# EAGLE design backplane_new (EAGLE 8.0.2)
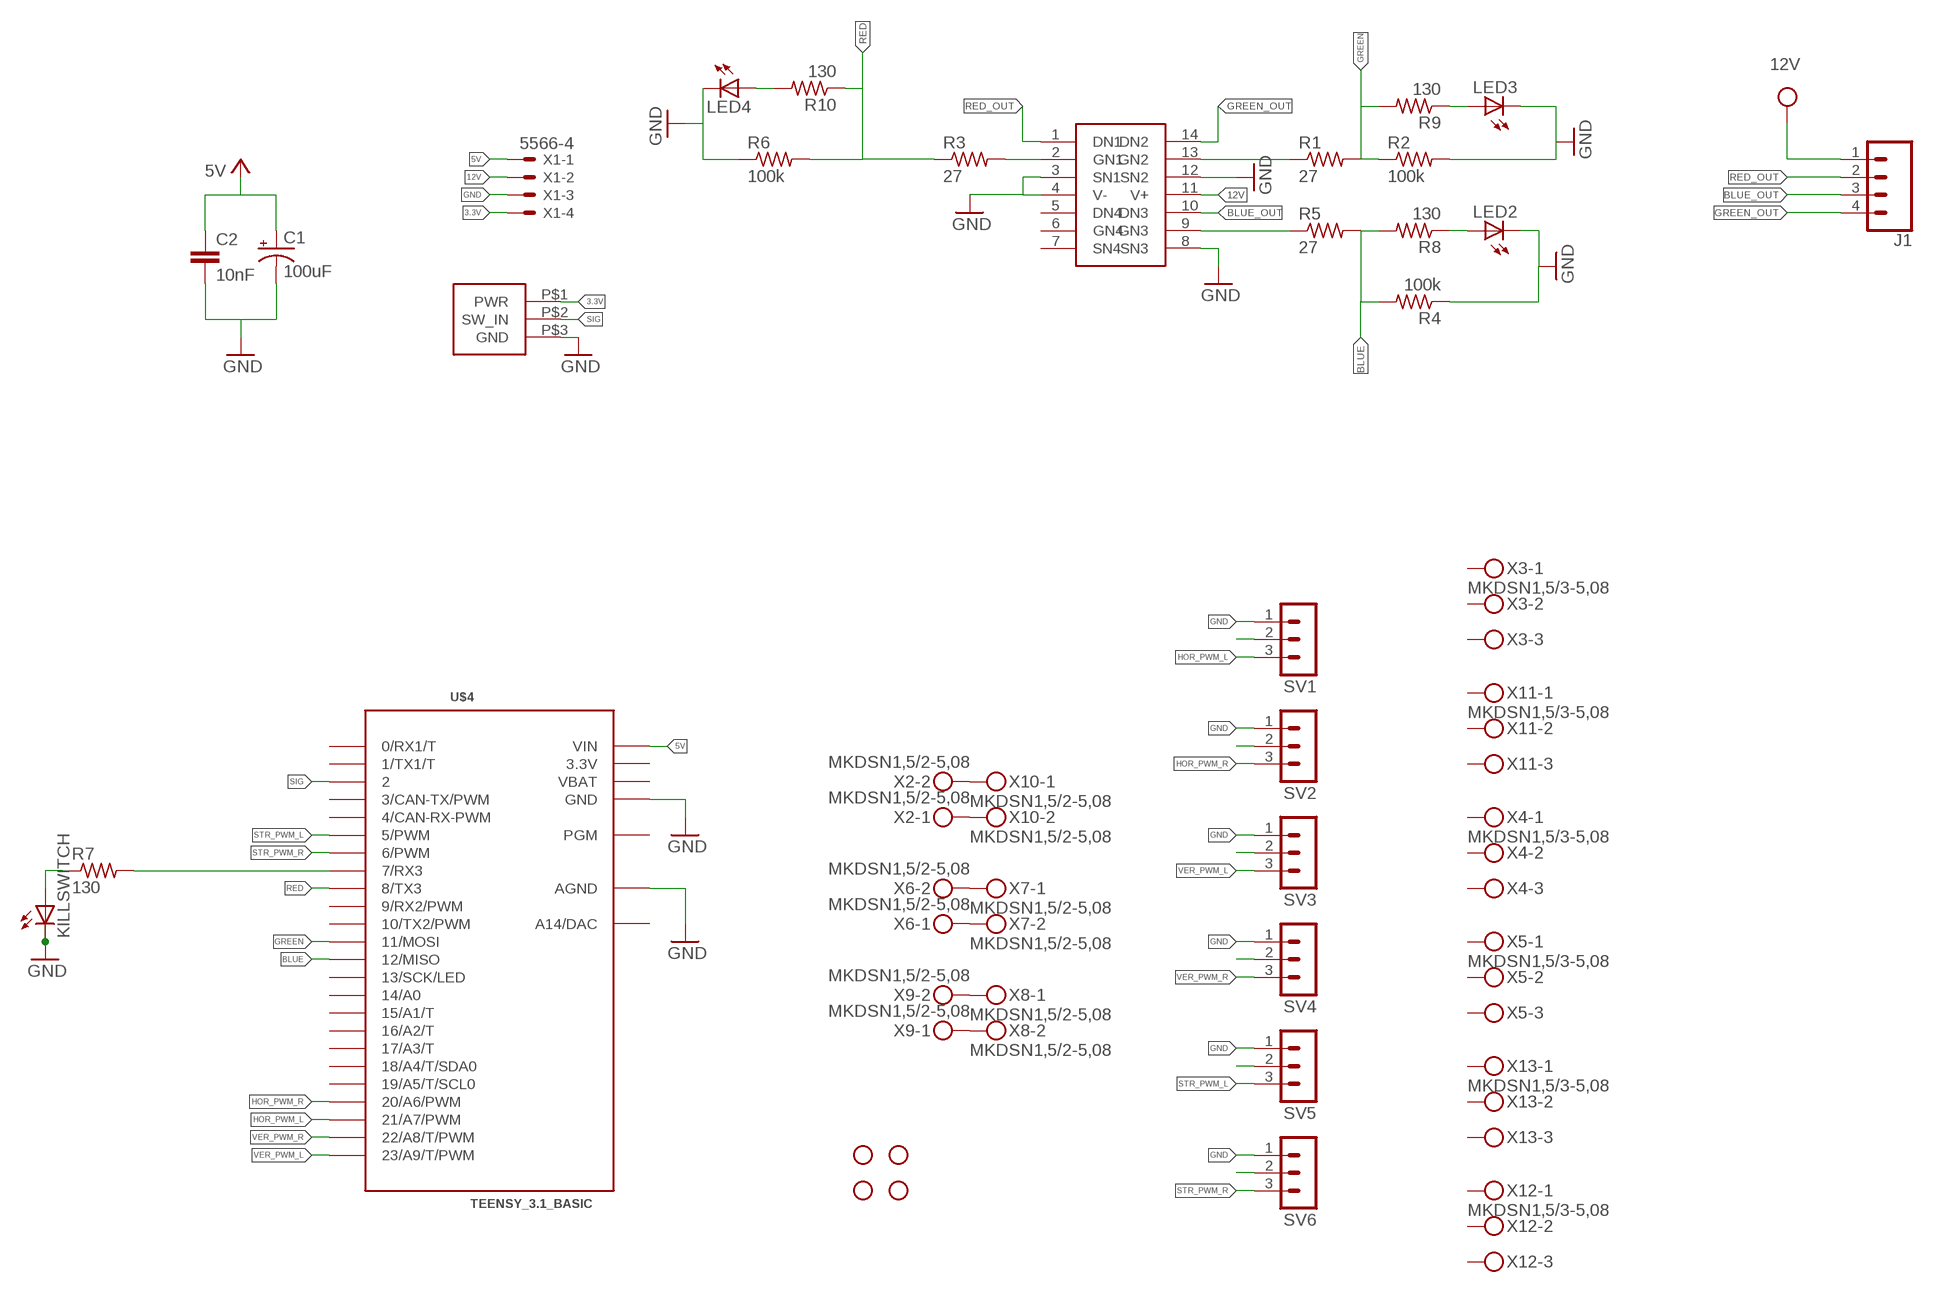
[diagram p0: schematic, sheet 1]

## Parts
C1  100uF  CPOL-USE5-10.5  [E5-10,5]
C2  10nF  C-EUC0805  [C0805]
H1  STAND-OFF  [STAND-OFF]
H2  STAND-OFF  [STAND-OFF]
H3  STAND-OFF  [STAND-OFF]
H5  STAND-OFF  [STAND-OFF]
J1  CONN_04POLAR  [MOLEX-1X4]
KILLSWITCH  LED5MM  [LED5MM]
LED2  LEDCHIP-LED0805  [CHIP-LED0805]
LED3  LEDCHIP-LED0805  [CHIP-LED0805]
LED4  LEDCHIP-LED0805  [CHIP-LED0805]
R1  27  R-US_R0805  [R0805]
R2  100k  R-US_R0805  [R0805]
R3  27  R-US_R0805  [R0805]
R4  100k  R-US_R0805  [R0805]
R5  27  R-US_R0805  [R0805]
R6  100k  R-US_R0805  [R0805]
R7  130  R-US_R0805  [R0805]
R8  130  R-US_R0805  [R0805]
R9  130  R-US_R0805  [R0805]
R10  130  R-US_R0805  [R0805]
SV1  MA03-1  [MA03-1]
SV2  MA03-1  [MA03-1]
SV3  MA03-1  [MA03-1]
SV4  MA03-1  [MA03-1]
SV5  MA03-1  [MA03-1]
SV6  MA03-1  [MA03-1]
U$2  KILL_SW  [KILL_SW]
U$3  ALD1160  [DIL14]
U$4  TEENSY_3.1_BASIC  [TEENSY_3.1_BASIC]
X1  5566-4  [5566-4]
X2  MKDSN1,5/2-5,08  [MKDSN1,5/2-5,08]
X3  MKDSN1,5/3-5,08  [MKDSN1,5/3-5,08]
X4  MKDSN1,5/3-5,08  [MKDSN1,5/3-5,08]
X5  MKDSN1,5/3-5,08  [MKDSN1,5/3-5,08]
X6  MKDSN1,5/2-5,08  [MKDSN1,5/2-5,08]
X7  MKDSN1,5/2-5,08  [MKDSN1,5/2-5,08]
X8  MKDSN1,5/2-5,08  [MKDSN1,5/2-5,08]
X9  MKDSN1,5/2-5,08  [MKDSN1,5/2-5,08]
X10  MKDSN1,5/2-5,08  [MKDSN1,5/2-5,08]
X11  MKDSN1,5/3-5,08  [MKDSN1,5/3-5,08]
X12  MKDSN1,5/3-5,08  [MKDSN1,5/3-5,08]
X13  MKDSN1,5/3-5,08  [MKDSN1,5/3-5,08]

## Nets
3.3V: U$2.P$1(PWR) X1.4
5V: C1.+ C2.1 U$4.VIN X1.1 ; supply symbol labelled VCC
12V: J1.1 U$3.11(V+) X1.2 ; supply symbol labelled VCC
BLUE: R4.2 R5.2 R8.2 U$4.12(12/MISO)
BLUE_OUT: J1.3 U$3.10(DN3)
GND: C1.- C2.2 KILLSWITCH.K(C) LED2.C LED3.C LED4.C R2.2 R4.1 R6.1 SV1.1 SV2.1 SV3.1 SV4.1 SV5.1 SV6.1 U$2.P$3(GND) U$3.3(SN1) U$3.4(V-) U$3.8(SN3) U$3.12(SN2) U$4.AGND U$4.GND U$4.GND1(GND) X1.3
GREEN: R1.2 R2.1 R9.2 U$4.11(11/MOSI)
GREEN_OUT: J1.4 U$3.14(DN2)
HOR_PWM_L: SV1.3 U$4.21/A7(21/A7/PWM)
HOR_PWM_R: SV2.3 U$4.20/A6(20/A6/PWM)
N$1: X2.1 X10.2
N$2: X2.2 X10.1
N$3: X6.2 X7.1
N$4: X6.1 X7.2
N$5: X8.2 X9.1
N$6: X8.1 X9.2
N$7: R7.2 U$4.7(7/RX3)
N$8: KILLSWITCH.A R7.1
N$9: R3.2 U$3.2(GN1)
N$10: SV1.2
N$11: R1.1 U$3.13(GN2)
N$12: R5.1 U$3.9(GN3)
N$13: SV2.2
N$14: LED2.A R8.1
N$15: LED4.A R10.2
N$16: SV3.2
N$17: LED3.A R9.1
N$19: SV4.2
N$22: SV5.2
N$25: SV6.2
RED: R3.1 R6.2 R10.1 U$4.8(8/TX3)
RED_OUT: J1.2 U$3.1(DN1)
SIG: U$2.P$2(SW_IN) U$4.2
STR_PWM_L: SV5.3 U$4.5(5/PWM)
STR_PWM_R: SV6.3 U$4.6(6/PWM)
VER_PWM_L: SV3.3 U$4.23/A9(23/A9/T/PWM)
VER_PWM_R: SV4.3 U$4.22/A8(22/A8/T/PWM)
Unconnected: U$3.5(DN4) U$3.6(GN4) U$3.7(SN4) U$4.0(0/RX1/T) U$4.1(1/TX1/T) U$4.3(3/CAN-TX/PWM) U$4.4(4/CAN-RX-PWM) U$4.9(9/RX2/PWM) U$4.10(10/TX2/PWM) U$4.13(13/SCK/LED) U$4.14/A0 U$4.15/A1(15/A1/T) U$4.16/A2(16/A2/T) U$4.17/A3(17/A3/T) U$4.18/A4(18/A4/T/SDA0) U$4.19/A5(19/A5/T/SCL0) U$4.A14(A14/DAC) U$4.PGM X3.1 X3.2 X3.3 X4.1 X4.2 X4.3 X5.1 X5.2 X5.3 X11.1 X11.2 X11.3 X12.1 X12.2 X12.3 X13.1 X13.2 X13.3

## Notes on the sheet
- 5V

## Power pins joined to a net without a drawn wire
3.3V: U$4.3.3V U$4.3.3V1(3.3V)
VBAT: U$4.VBAT

## Library data of the parts
C1 = rcl:CPOL-US: POLARIZED CAPACITOR, American symbol
C2 = rcl:C-EU: CAPACITOR, European symbol
H1-H3 H5 = SparkFun-Hardware:STAND-OFF: Stand Off Drill holes for mechanically mounting via screws, standoffs, etc. Note: Use the keepout ring to avoid running the screw head into surrounding components. Variant Overviews STAND-OFF - Mechanical footprint for a #4 phillips button head screw. STAND-OFF-TIGHT - Mechanical footprint for a #4 phillips button head screw, Example SparkFun Products Screw - Phillips Head (1/4", 4-40, 10 pack) <https://www.sparkfun.com/products/10453> (PRT-10453) Screw - Phillips Head (1/2", 4-40, 10 pack) <https://www.sparkfun.com/products/10452> (PRT-10452) Screw - Phillips Head (3/4", 4-40, 10 pack) <https://www.sparkfun.com/products/10451> (PRT-10451) Screw - Phillips Head (1", 4-40, 10 pack) <https://www.sparkfun.com/products/10450> (PRT-10450)
J1 = SparkFun-Connectors:CONN_04: Multi connection point. Often used as Generic Header-pin footprint for 0.1 inch spaced/style header connections On any of the 0.1 inch spaced packages, you can populate with these: Break Away Headers - Straight <https://www.sparkfun.com/products/116> (PRT-00116) Break Away Male Headers - Right Angle <https://www.sparkfun.com/products/553> (PRT-00553) Female Headers <https://www.sparkfun.com/products/115> (PRT-00115) Break Away Headers - Machine Pin <https://www.sparkfun.com/products/117> (PRT-00117) Break Away Female Headers - Swiss Machine Pin <https://www.sparkfun.com/products/743> (PRT-00743) For SCREWTERMINALS and SPRING TERMINALS visit here: Screw Terimnals on SparkFun.com <https://www.sparkfun.com/search/results?term=Screw+Terminals> (5mm/3.5mm/2.54mm spacing) This device is also useful as a general connection point to wire up your design to another part of your project. Our various solder wires solder well into these plated through hole pads. Hook-Up Wire - Assortment (Stranded, 22 AWG) <https://www.sparkfun.com/products/11375> (PRT-11375) Hook-Up Wire - Assortment (Solid Core, 22 AWG) <https://www.sparkfun.com/products/11367> (PRT-11367) View the entire wire category on our website here <https://www.sparkfun.com/categories/141> Special notes: Molex polarized connector foot print use with SKU : PRT-08231 with associated crimp pins and housings. 1MM SMD Version SKU: PRT-10208; PROD_ID: CONN-08186; SF_ID: PRT-08231
KILLSWITCH = led:LED: LED
LED2-LED4 = adafruit:LED: LED
R1-R6 R8-R10 = rcl:R-US_: RESISTOR, American symbol
R7 = resistor:R-US_: RESISTOR, American symbol
SV1-SV6 = con-lstb:MA03-1: PIN HEADER; OC_FARNELL: unknown; OC_NEWARK: unknown
U$2 = motor:KILL_SW
U$3 = motor:ALD1160
U$4 = Teensy_3_Series_Board_v1.0:TEENSY_3.1_BASIC: Footprint for Teensy 3.1 board using all pin connections on the outer perimeter
X1 = motor:5566-4: Mini FIT connector 4 pol Source: http://www.molex.com; OC_FARNELL: unknown; OC_NEWARK: unknown
X2 X6-X10 = con-phoenix-508:MKDSN1,5/2-5,08: MKDSN 1,5/ 2-5,08 Printklemme Nennstrom: 13,5 A Nennspannung: 250 V Rastermaß: 5,08 mm Polzahl: 2 Anschlussart: Schraubanschluss Montage: Löten Anschlussrichtung Leiter/Platine: 0 ° Artikelnummer: 1729128 Source: http://eshop.phoenixcontact.com .. 1729128.pdf
X3-X5 X11-X13 = con-phoenix-508:MKDSN1,5/3-5,08: MKDSN 1,5/ 3-5,08 Printklemme Nennstrom: 13,5 A Nennspannung: 250 V Rastermaß: 5,08 mm Polzahl: 3 Anschlussart: Schraubanschluss Montage: Löten Anschlussrichtung Leiter/Platine: 0 ° Artikelnummer: 1729131 Source: http://eshop.phoenixcontact.com .. 1729131.pdf

## Board
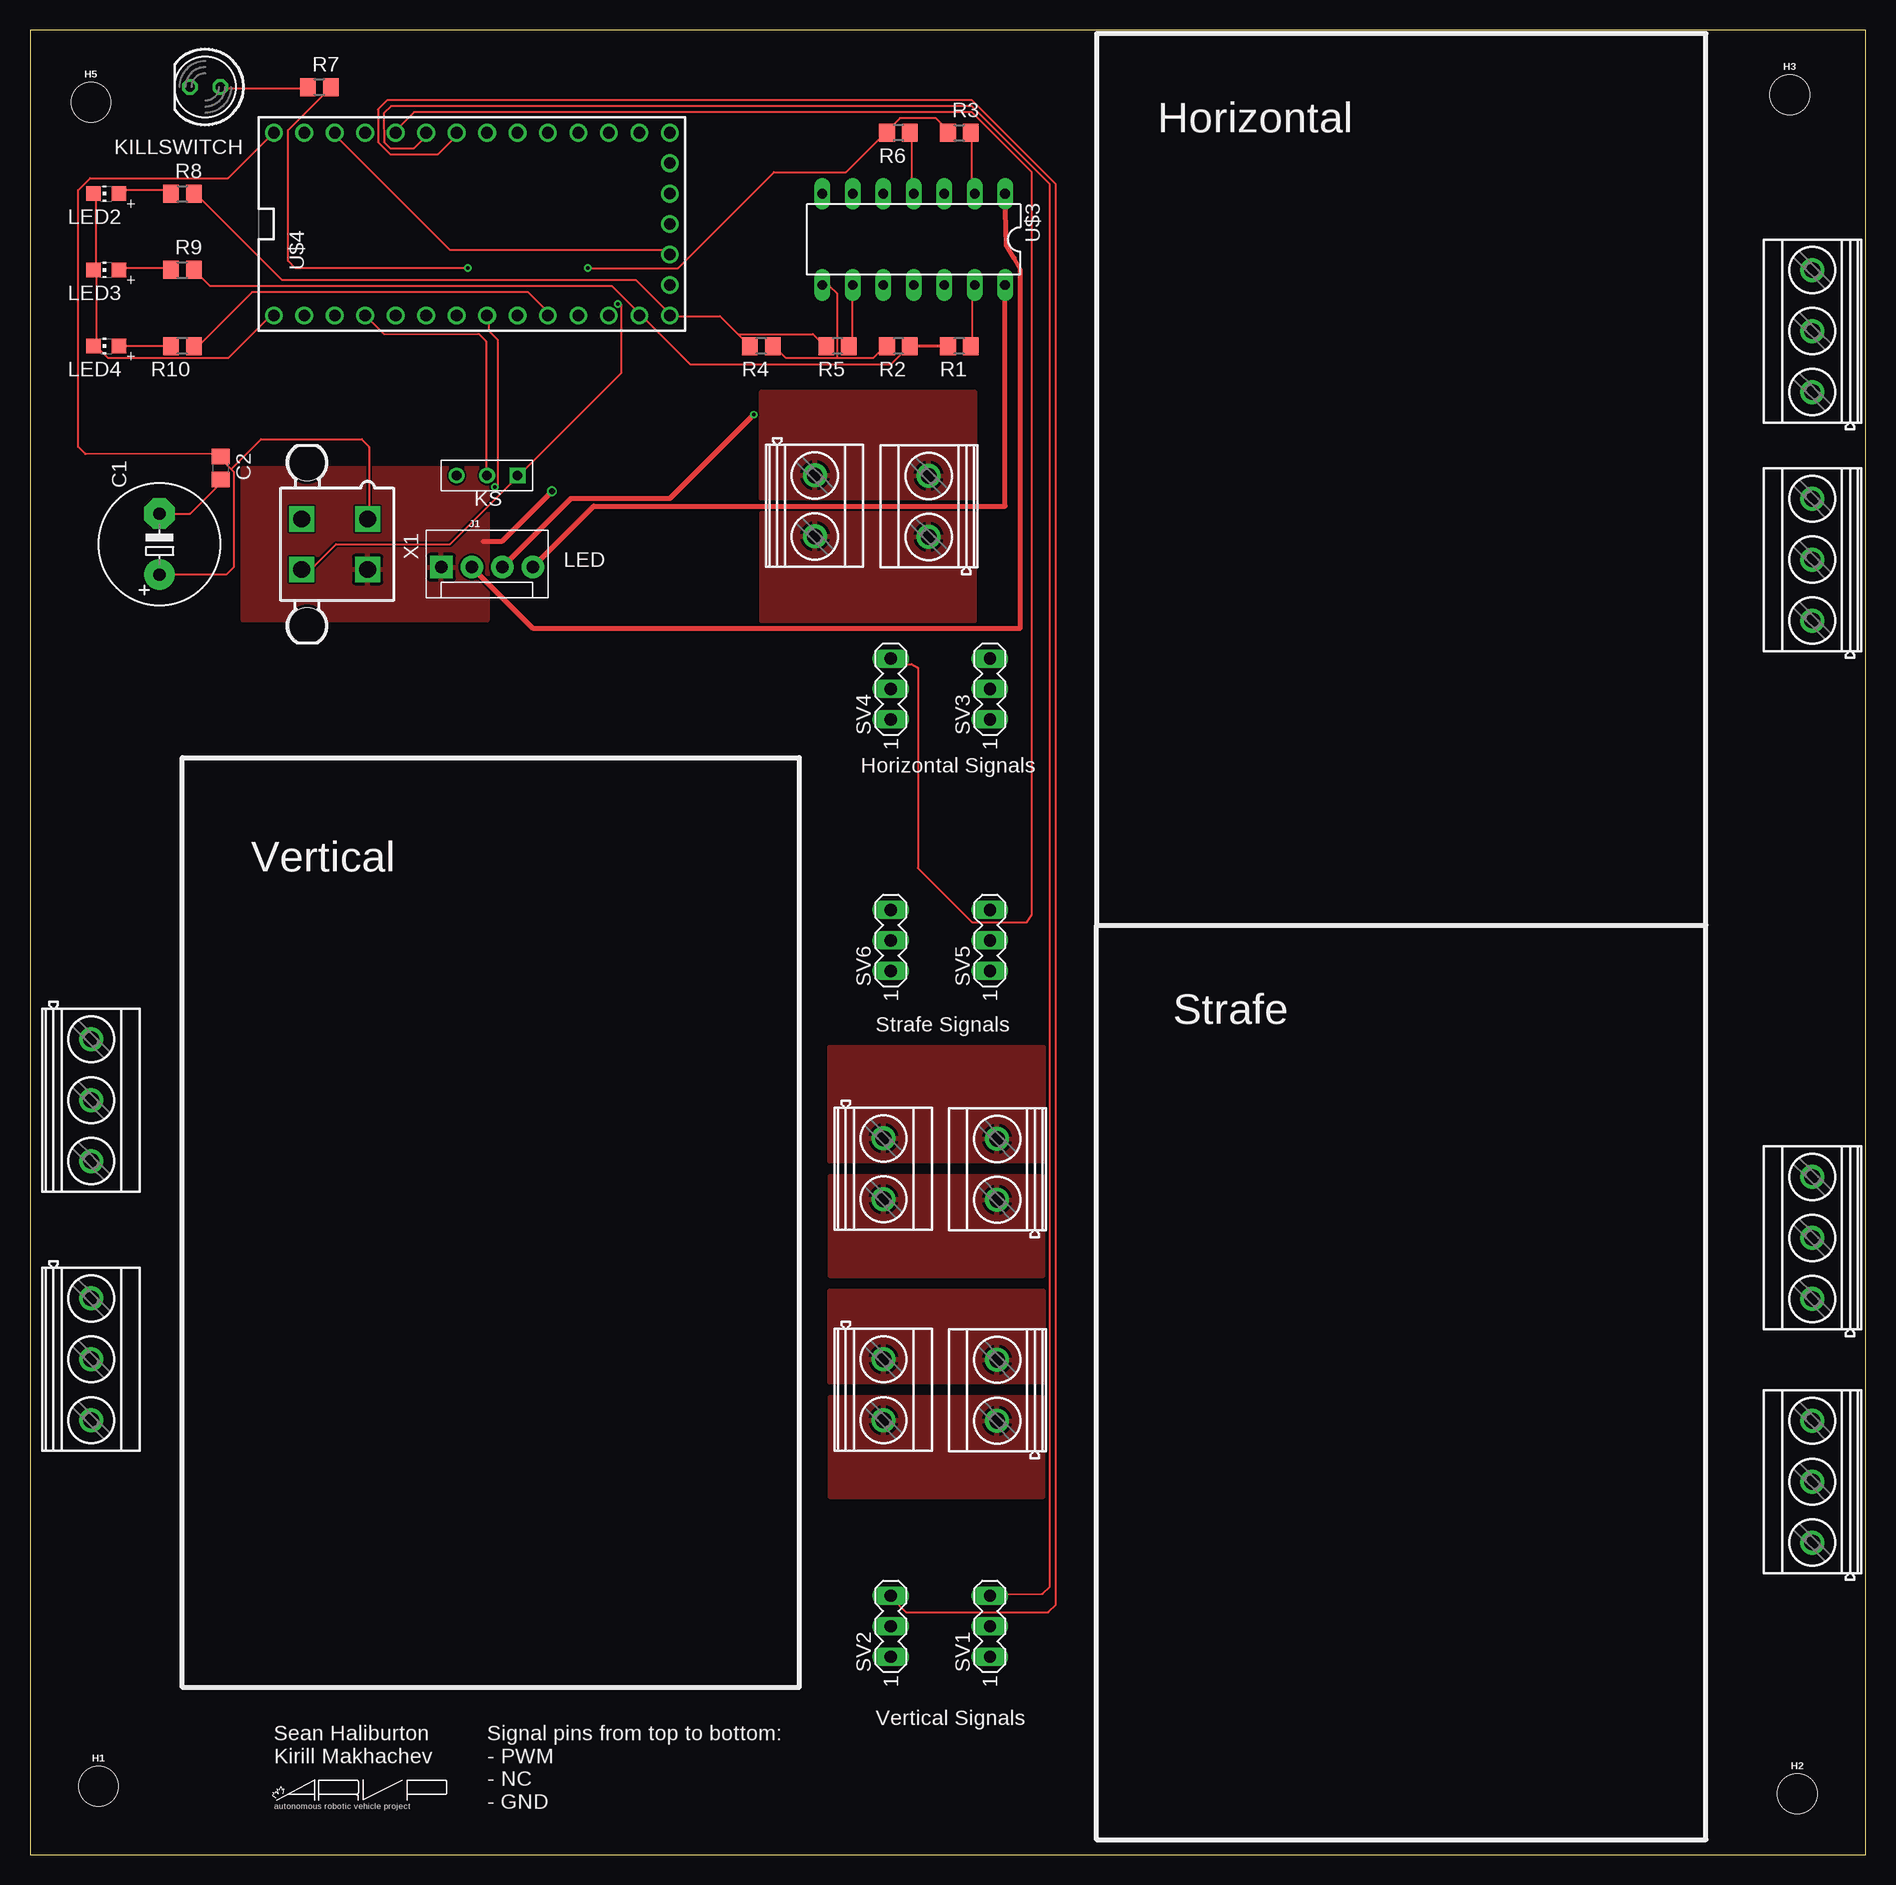
[diagram p1: board, top side]
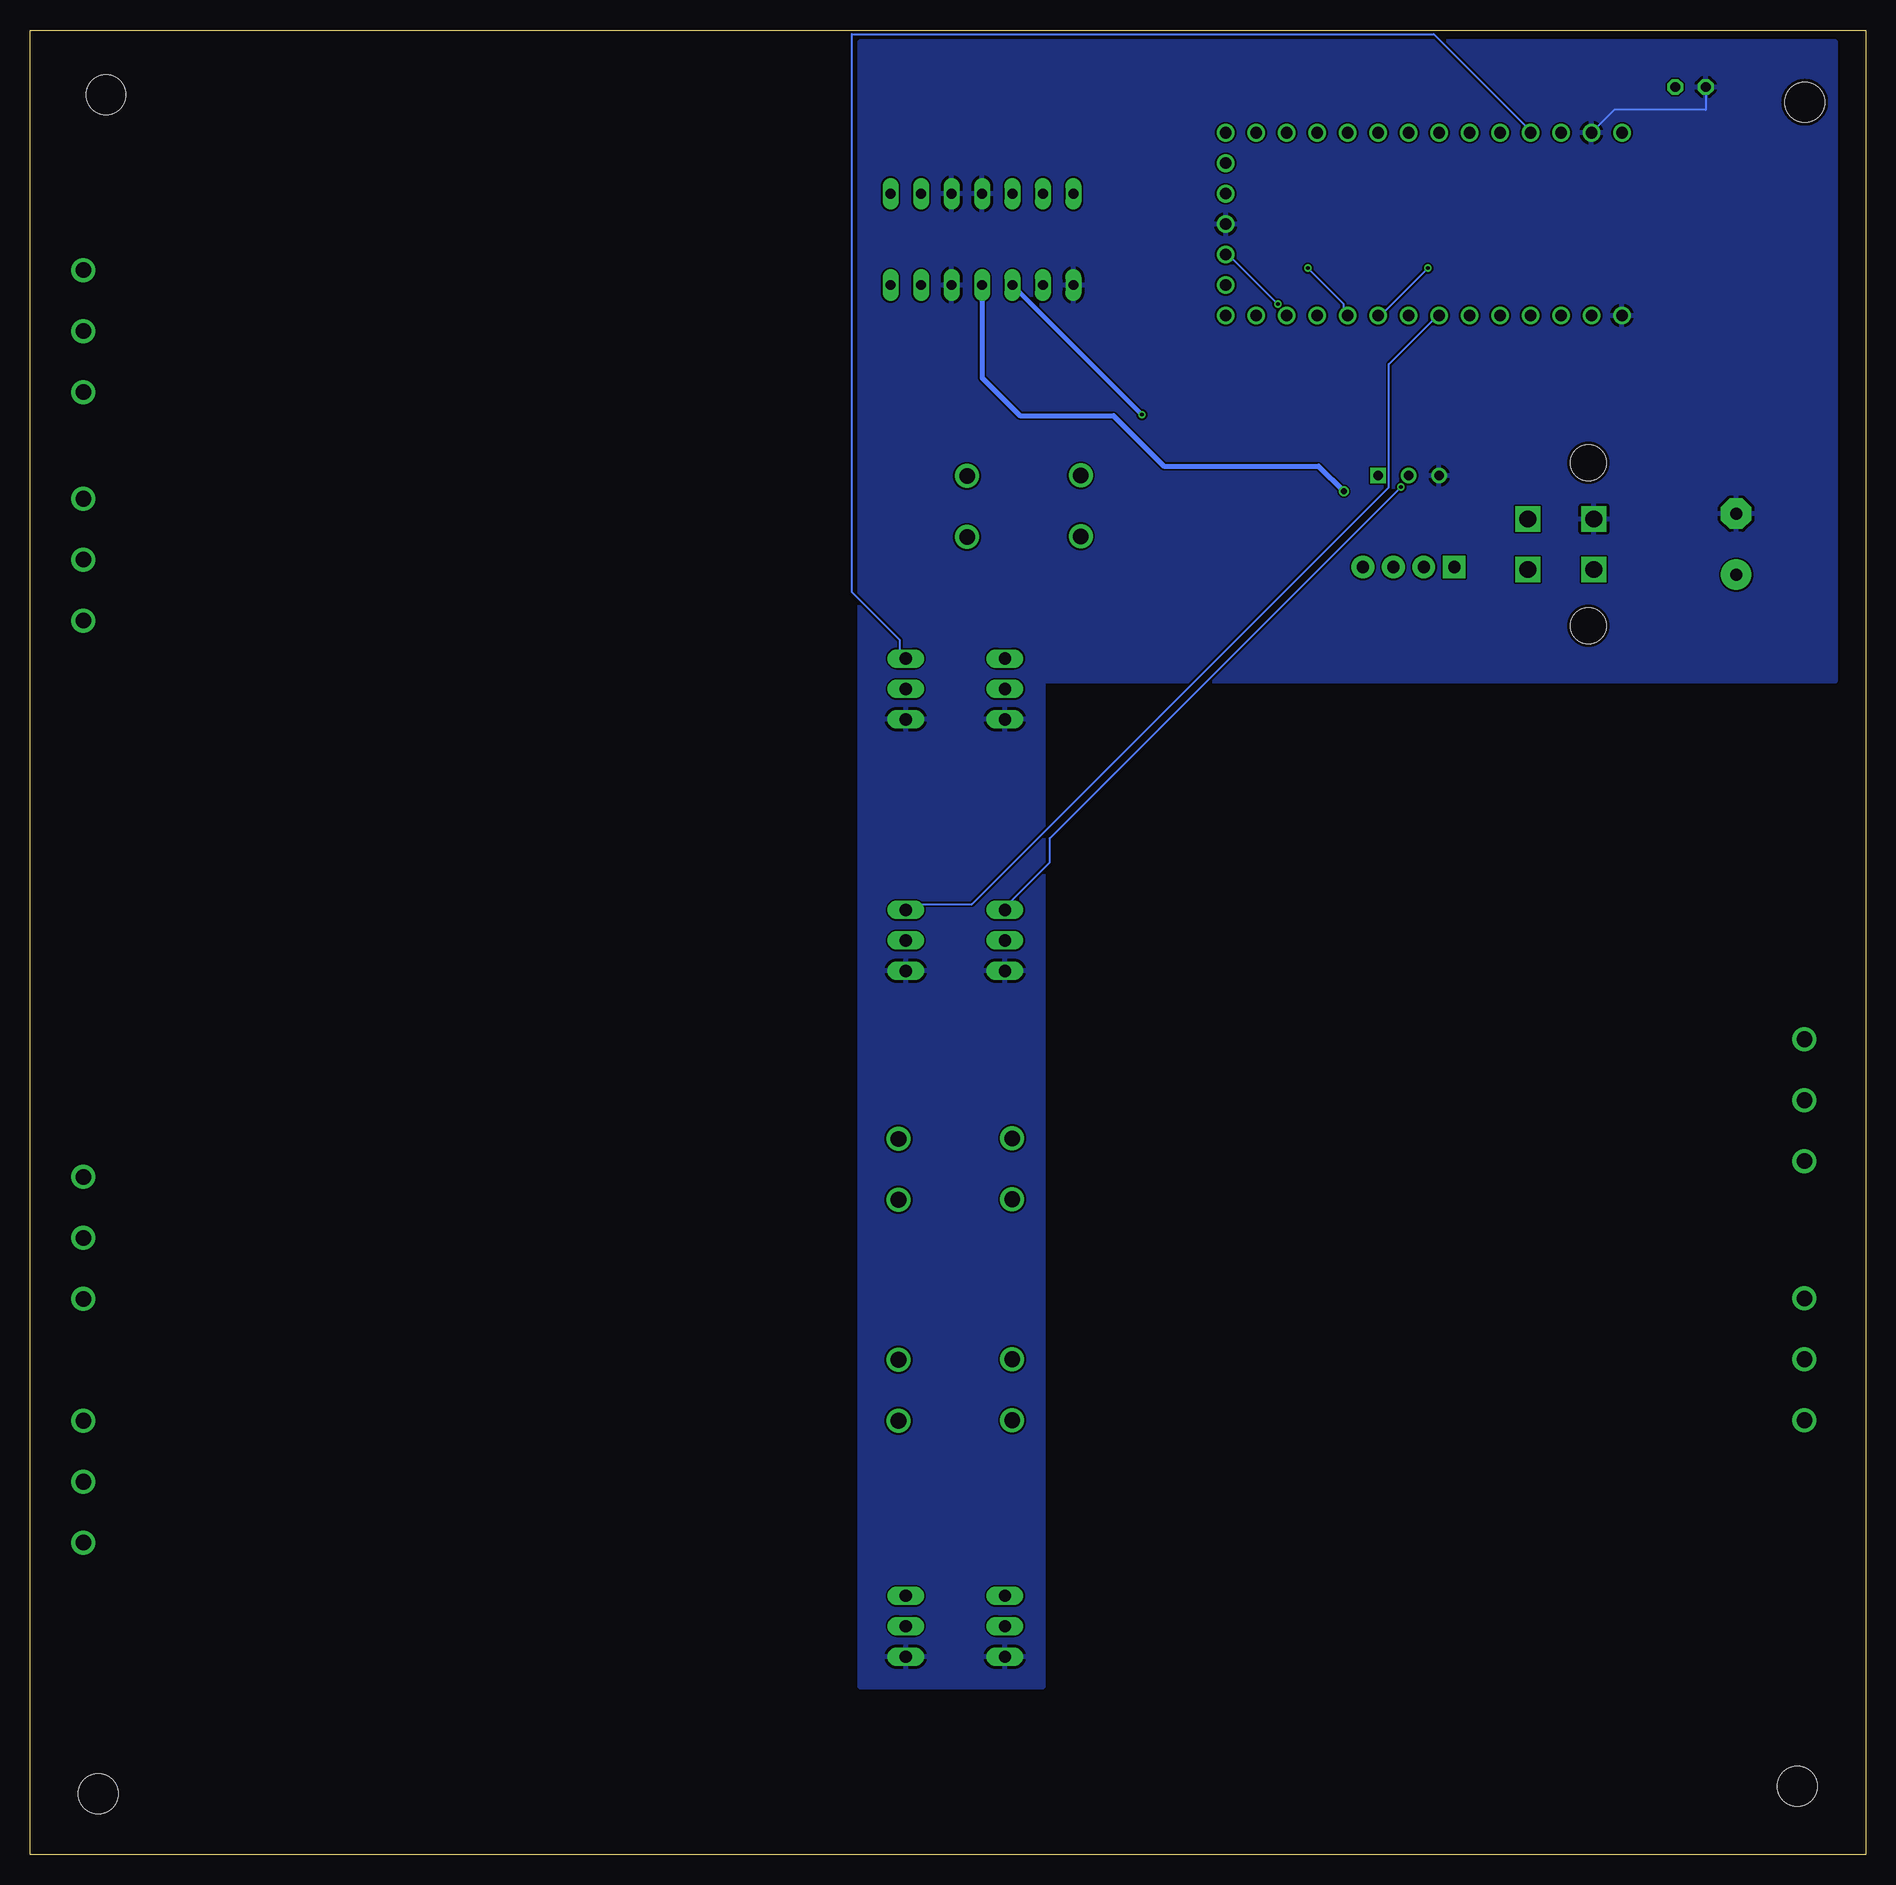
[diagram p2: board, bottom side, seen from below]

Size 153.01 x 152.07 mm. Coordinates in mm from the lower left corner, seen from the top.
Outline: 0,0 153.01,0 153.01,152.07 0,152.07 0,0
Copper layers (1*16): Top 0.035mm / dielectric 1.5mm / Bottom 0.035mm
Design rules "ITead_rule": minimum track width 6mil, minimum drill 12mil, track to track 6mil, track to pad 6mil, pad to pad 6mil, via to via 6mil, smd to smd 0mil, copper to edge 10mil, drill to drill 10mil, minimum pad ring 10mil, minimum via ring 6mil, stop-mask expansion 2mil, vias tented up to drill 100mil, thermal gap 10mil

### Footprints (pad centres in the part's own frame; a part is rotated, then mirrored left to right if it is on the bottom)
E5-10,5 = drill 1.016 pad 2.54: + -2.54,0 | drill 1.016 pad 2.54 octagon: - 2.54,0
C0805 = smd 1.3 x 1.5: 1 -0.95,0; 2 0.95,0
STAND-OFF = hole 3.302: 0,0
MOLEX-1X4 = drill 1.016 pad 1.88 square: 1 0,0 | drill 1.016 pad 1.88: 2 2.54,0; 3 5.08,0; 4 7.62,0
LED5MM = drill 0.813 octagon: A -1.27,0; K 1.27,0
CHIP-LED0805 = smd 1.2 x 1.2: A 0,-1.05; C 0,1.05
R0805 = smd 1.3 x 1.5: 1 -0.95,0; 2 0.95,0
MA03-1 = drill 1.016 long: 1 -2.54,0; 2 0,0; 3 2.54,0
KILL_SW = drill 0.8 square: P$1 -1.27,0 | drill 0.8: P$2 1.27,0; P$3 3.81,0
DIL14 = drill 0.813 long: 1 -3.81,6.35; 2 -3.81,3.81; 3 -3.81,1.27; 4 -3.81,-1.27; 5 -3.81,-3.81; 6 -3.81,-6.35; 7 -3.81,-8.89; 8 3.81,-8.89; 9 3.81,-6.35; 10 3.81,-3.81; 11 3.81,-1.27; 12 3.81,1.27; 13 3.81,3.81; 14 3.81,6.35
TEENSY_3.1_BASIC = drill 0.965: 0 -7.62,13.97; 1 -7.62,11.43; 2 -7.62,8.89; 3 -7.62,6.35; 3.3V 7.62,11.43; 3.3V1 -2.54,-16.51; 4 -7.62,3.81; 5 -7.62,1.27; 6 -7.62,-1.27; 7 -7.62,-3.81; 8 -7.62,-6.35; 9 -7.62,-8.89; 10 -7.62,-11.43; 11 -7.62,-13.97; 12 -7.62,-16.51; 13 7.62,-16.51; 14/A0 7.62,-13.97; 15/A1 7.62,-11.43; 16/A2 7.62,-8.89; 17/A3 7.62,-6.35; 18/A4 7.62,-3.81; 19/A5 7.62,-1.27; 20/A6 7.62,1.27; 21/A7 7.62,3.81; 22/A8 7.62,6.35; 23/A9 7.62,8.89; A14 5.08,-16.51; AGND 7.62,13.97; GND -7.62,16.51; GND1 0,-16.51; PGM 2.54,-16.51; VBAT -5.08,-16.51; VIN 7.62,16.51
5566-4 = drill 1.4 square: 1 2.1,-2.75; 2 -2.1,-2.75; 3 2.1,2.75; 4 -2.1,2.75 | hole 3: 6.8,2.29; -6.8,2.29
MKDSN1,5/2-5,08 = drill 1.3 pad 2: 1 -2.561,0.025; 2 2.519,0.025
MKDSN1,5/3-5,08 = drill 1.3 pad 2: 1 -7.641,0.025; 2 -2.561,0.025; 3 2.519,0.025

### Placement (x,y rotation side)
C1  10.79,109.22 90 top
C2  15.88,115.57 270 top
H1  5.71,5.71 0 top
H2  147.32,5.08 0 top
H3  146.69,146.69 0 top
H5  5.08,146.05 0 top
J1  34.29,107.31 0 top
KILLSWITCH  14.61,147.32 180 top
LED2  6.35,138.43 90 top
LED3  6.35,132.08 90 top
LED4  6.35,125.73 90 top
R1  77.47,125.73 180 top
R2  72.39,125.73 180 top
R3  77.47,143.51 0 top
R4  60.96,125.73 180 top
R5  67.31,125.73 180 top
R6  72.39,143.51 180 top
R7  24.13,147.32 0 top
R8  12.7,138.43 0 top
R9  12.7,132.08 0 top
R10  12.7,125.73 180 top
SV1  80.01,19.05 90 top
SV2  71.75,19.05 90 top
SV3  80.01,97.16 90 top
SV4  71.75,97.16 90 top
SV5  80.01,76.2 90 top
SV6  71.75,76.2 90 top
U$1  [ARVP]  20.32,3.81 0 top
U$2  39.37,114.94 180 top
U$3  74.93,134.62 270 top
U$4  36.83,135.89 90 top
X1  25.4,109.22 90 top
X2  71.12,38.73 270 top
X3  148.59,129.54 90 top
X4  148.59,53.97 90 top
X5  148.59,33.65 90 top
X6  80.64,57.15 90 top
X7  71.12,57.15 270 top
X8  65.41,112.4 270 top
X9  74.93,112.4 90 top
X10  80.64,38.73 90 top
X11  148.59,110.49 90 top
X12  5.08,60.32 270 top
X13  5.08,38.73 270 top

### Tracks (layer width: path | path; a pad name or v marks a point on that pad's centre or on a via)
3.3V  (via drill 0.3)
  Top 0.152: X1.4 23,107.23 23.5,107.23 25.5,109.23 35,109.23 40.5,114.73 U$2.P$1 40.75,114.98 49.25,123.48 49.25,129.23 v49,129.23 | U$4.3.3V 25.5,143.23 35,133.73 53,133.73 U$4.3.3V1
  Bottom 0.152: v49,129.23 53.25,133.48 U$4.3.3V1
5V
  Top 0.152: 16.75,115.48 17,115.23 17,107.33 16.4,106.73 11,106.73 C1.+ | 16.75,115.48 16,116.23 C2.1 15.5,116.73 4.65,116.74 4.59,116.74 4,117.33 4,138.73 5,139.73 16.5,139.73 20,143.23 U$4.VIN | 16.75,115.48 19.25,117.98 27.65,117.98 28.27,117.36 28.27,117.27 28.25,111.48 X1.1
12V  (via drill 0.5 pad 0.25)
  Top 0.4: v43.5,113.63 39.3,109.43 37.8,109.43
  Bottom 0.4: U$3.11 73.66,123.09 70.5,119.93 62.7,119.93 58.5,115.73 45.6,115.73 v43.5,113.63
  pour Top: 17.78,115.57 38.1,115.57 38.1,102.87 17.78,102.87
BLUE
  Top 0.152: R8.2 14,138.23 21,131.23 50.5,131.23 53,128.73 U$4.12 53.5,128.23 57.5,128.23 59,126.73 | 59,126.73 R4.2 | 59,126.73 65.25,126.73 66.25,125.73 R5.2
BLUE_OUT  (via drill 0.3)
  Top 0.42: v60.33,120.02 53.34,113.03 45.09,113.03 J1.3
  Bottom 0.381: v60.33,120.02 U$3.10
GND
  Top 0.152: C1.- 13.34,111.76 15.88,114.3 C2.2 | 5.5,125.73 5.5,131.73 LED3.C 5.5,132.23 5.5,138.23 LED2.C | R6.1 73.5,143.23 73.5,138.73 U$3.4 | 5.5,125.73 6.5,124.73 16.5,124.73 20,128.23 U$4.GND | 5.5,125.73 LED4.C | 67.25,124.73 70.25,124.73 71.25,125.73 R2.2 | 67.25,124.73 63,124.73 62,125.73 R4.1 | 67.25,124.73 67.25,130.13 66.65,130.73 66.25,130.73 U$3.8
  Bottom 0.152: U$4.AGND 20.95,145.41 13.34,145.41 KILLSWITCH.K
  pour Bottom: 83.82,13.97 83.82,151.13 2.54,151.13 2.54,97.79 68.58,97.79 68.58,13.97
GREEN
  Top 0.152: R9.2 15,130.73 48.5,130.73 50.5,128.73 U$4.11 51,128.23 55,124.23 71.75,124.23 73.25,125.73 R2.1
  Top 0.254: R1.2 R2.1
GREEN_OUT
  Top 0.42: U$3.14 81.28,112.4 46.99,112.4 J1.4
HOR_PWM_L
  Top 0.152: U$4.21/A7 33,143.23 32,142.23 30,142.23 29.5,142.73 29.49,144.78 29.49,145.12 30.1,145.73 78.5,145.73 85,139.23 85,22.33 84.41,21.74 84.33,21.74 80.5,21.73 SV1.3
HOR_PWM_R
  Top 0.152: U$4.20/A6 35.5,143.23 34,141.73 30,141.73 29,142.73 29.01,145.41 29.01,145.45 29.79,146.23 78.5,146.23 85.5,139.23 85.5,20.83 84.91,20.24 84.91,20.22 73,20.23 72,21.23 SV2.3
N$1
  pour Top: 66.67,46.99 84.45,46.99 84.45,39.37 66.67,39.37
N$2
  pour Top: 66.67,38.1 66.67,29.84 84.45,29.84 84.45,38.1
N$3
  pour Top: 66.67,67.31 84.45,67.31 84.45,57.78 66.67,57.78
N$4
  pour Top: 66.67,56.51 66.67,48.26 84.45,48.26 84.45,56.51
N$5
  pour Top: 60.96,111.76 60.96,102.87 78.74,102.87 78.74,111.76
N$6
  pour Top: 60.96,121.92 78.74,121.92 78.74,113.03 60.96,113.03
N$7  (via drill 0.3)
  Top 0.152: v36.5,132.23 22.1,132.23 21.5,132.83 21.5,143.73 25,147.23 R7.2
  Bottom 0.152: v36.5,132.23 40.5,128.23 U$4.7
N$8
  Top 0.152: R7.1 23,147.23 16,147.23 KILLSWITCH.A
N$9
  Top 0.152: R3.2 78.5,143.23 78.5,138.73 U$3.2
N$11
  Top 0.152: R1.1 78.5,125.73 78.5,130.73 U$3.13
N$12
  Top 0.152: R5.1 68.5,125.73 68.5,130.73 U$3.9
N$14
  Top 0.152: LED2.A 7.5,138.73 11.5,138.73 R8.1
N$15
  Top 0.152: R10.2 LED4.A
N$17
  Top 0.152: LED3.A 7.5,132.23 11.5,132.23 R9.1
RED  (via drill 0.3)
  Top 0.152: R3.1 76.5,143.73 75.5,144.73 72.5,144.73 71.5,143.73 R6.2 71,143.23 68,140.23 62,140.23 54,132.23 v46.5,132.23 | R10.1 14,125.73 18.5,130.23 41.5,130.23 43,128.73 U$4.8
  Bottom 0.152: v46.5,132.23 43.5,129.23 43.5,128.73 U$4.8
RED_OUT
  Top 0.381: 82.55,132.08 82.03,133.06
  Top 0.42: U$3.1 81.39,134.09 82.03,133.06 | 82.55,132.08 82.55,102.23 41.91,102.23 J1.2
SIG
  Top 0.152: U$2.P$2 38,114.98 38,126.13 37.39,126.74 37.39,126.75 29.5,126.73 28,128.23 U$4.2
STR_PWM_L
  Bottom 0.152: U$4.5 35.75,128.23 39.75,124.23 39.75,113.98 74.5,79.23 80,79.23 80,78.98 SV5.3
STR_PWM_R  (via drill 0.3)
  Top 0.152: v38.75,113.98 39,113.98 39,126.23 38.25,126.98 38.25,128.23 U$4.6
  Bottom 0.152: v38.75,113.98 68,84.73 68,82.73 71.75,78.98 SV6.3
VER_PWM_L
  Bottom 0.152: U$4.23/A9 28,143.73 36,151.73 84.5,151.73 84.5,105.23 80.5,101.23 80.5,99.73 SV3.3
VER_PWM_R
  Top 0.152: U$4.22/A8 30.5,143.73 32,145.23 78.5,145.23 83.5,140.23 83.5,78.33 83.11,77.72 78.5,77.73 74,82.23 74,98.93 73.5,99.23 72,99.23 SV4.3

### Text on the board
tNames: Horizontal | LED | Horizontal Signals | Vertical | Strafe Signals | Strafe | Vertical Signals | Sean Haliburton / Kirill Makhachev | Signal pins from top to bottom: / - PWM / - NC / - GND